# Altium project Telit-GPS-SL871-Module-V1.1.PrjPcb
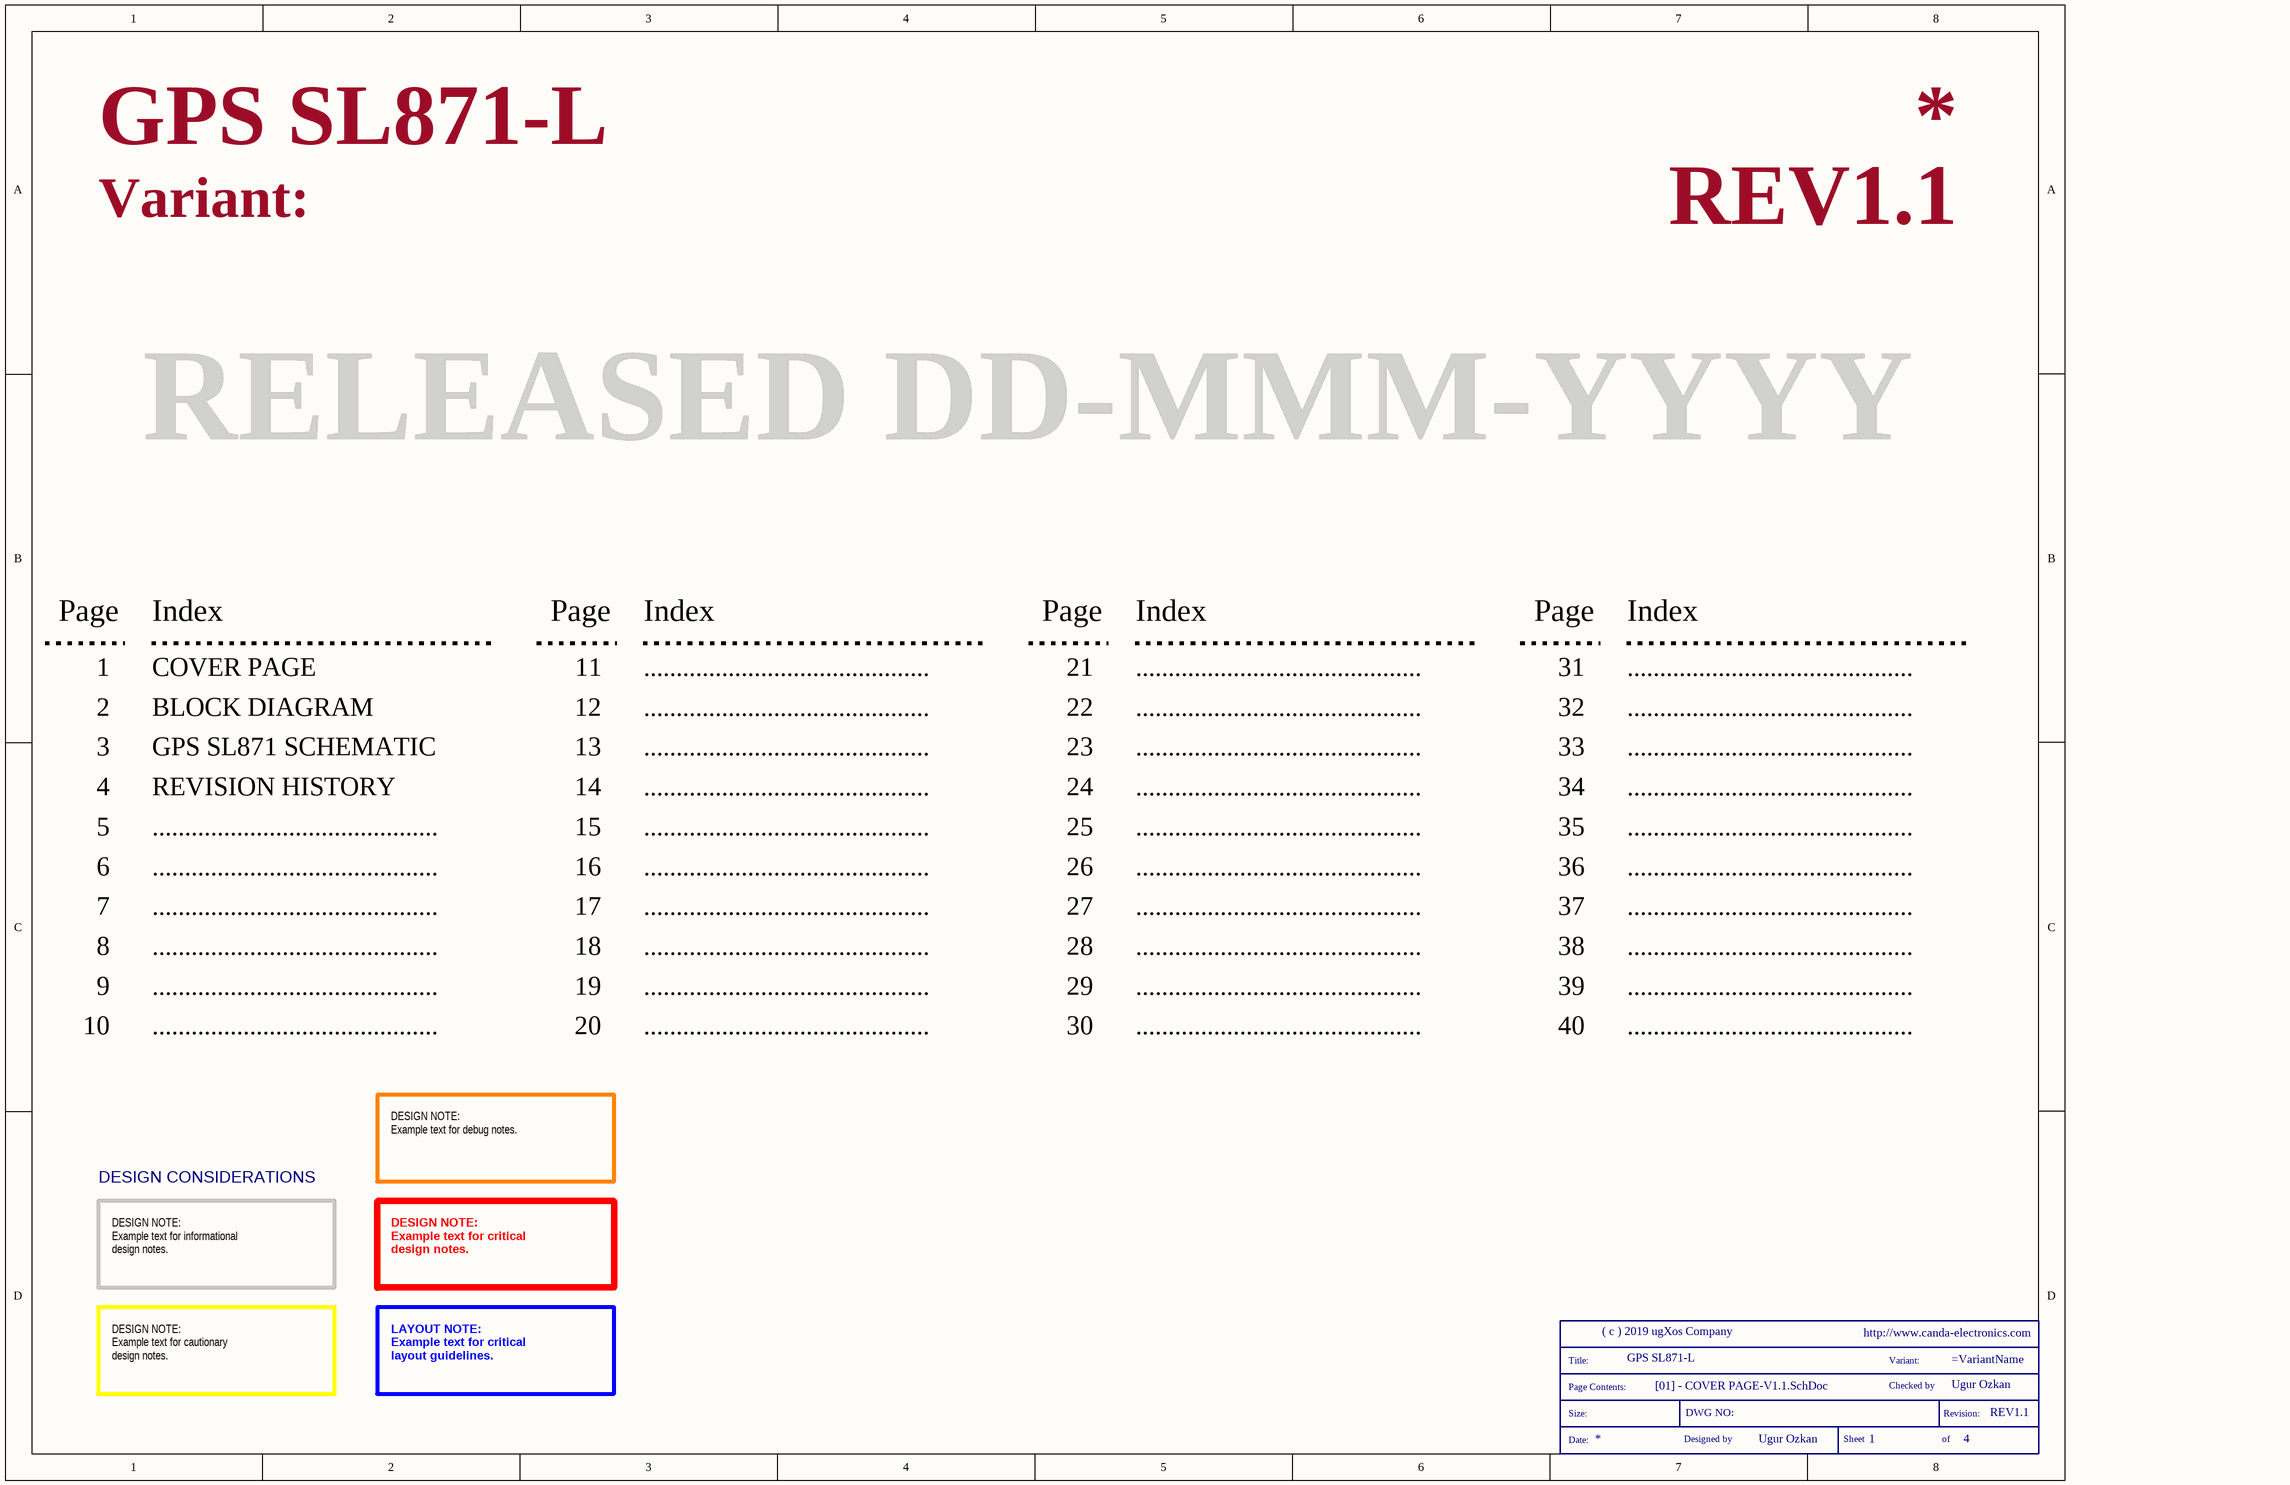
[diagram p0: [01] - COVER PAGE-V1.1.SchDoc]
Company: ( c ) 2019 ugXos Company; Designer: Ugur Ozkan; NotFitted: NF; Project: GPS SL871-L; VersionRevision: REV1.1; WebSite: http://www.canda-electronics.com
1 sheet, 1 parts. Net scope: global (net labels, ports and power ports of the same name join across sheets).
Board files: Telit-GPS-SL871-Module-V1.1.PcbDoc, Telit-GPS-SL871-Panel-V1.1.PcbDoc

## Sheet [01] - COVER PAGE-V1.1.SchDoc
size A3; DocumentNumber: 1; SheetNumber: 1; SheetTotal: 4

### Parts
*  SCH_TITLE  (value not drawn)  (graphical)

### Notes on the sheet
- Variant:
- RELEASED DD-MMM-YYYY
- Page
- Index
- 1
- COVER PAGE
- 11
- ............................................
- 21
- 31
- 2
- 3
- BLOCK DIAGRAM
- GPS SL871 SCHEMATIC
- 12
- 13
- 22
- 23
- 32
- 33
- 4
- 5
- REVISION HISTORY
- 14
- 15
- 24
- 25
- 34
- 35
- 6
- 16
- 26
- 36
- 7
- 8
- 17
- 18
- 27
- 28
- 37
- 38
- 9
- 10
- 19
- 20
- 29
- 30
- 39
- 40
- DESIGN NOTE:
  Example text for debug notes.
- DESIGN CONSIDERATIONS
- DESIGN NOTE:
  Example text for informational
  design notes.
- DESIGN NOTE:
  Example text for critical
  design notes.
- DESIGN NOTE:
  Example text for cautionary
  design notes.
- LAYOUT NOTE:
  Example text for critical
  layout guidelines.
- (in symbol SCH_TITLE) Title:; Variant:; Page Contents:; Checked by; Size:; DWG NO:; Revision:; Date:; Designed by; Sheet; of